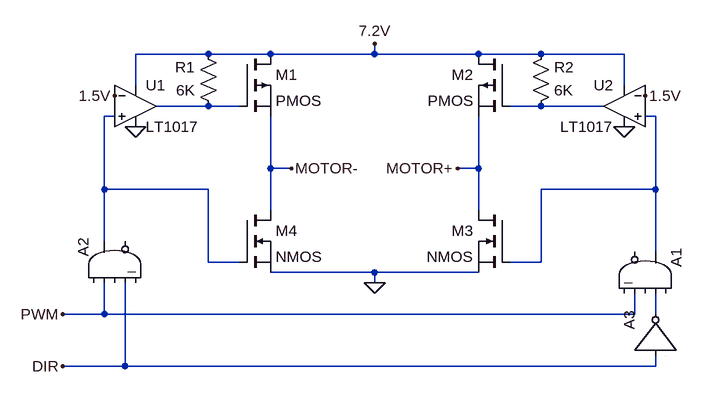
[diagram p0: schematic H_bridge.asc]
H_bridge.asc, the LTspice schematic file:
Version 4
SHEET 1 1216 680
WIRE 384 -32 272 -32
WIRE 480 -32 384 -32
WIRE 640 -32 640 -48
WIRE 640 -32 480 -32
WIRE 800 -32 640 -32
WIRE 896 -32 800 -32
WIRE 1024 -32 896 -32
WIRE 272 16 272 -32
WIRE 1024 16 1024 -32
WIRE 384 48 304 48
WIRE 432 48 384 48
WIRE 896 48 848 48
WIRE 992 48 896 48
WIRE 240 64 224 64
WIRE 1072 64 1056 64
WIRE 480 144 480 64
WIRE 512 144 480 144
WIRE 800 144 800 64
WIRE 800 144 768 144
WIRE 224 176 224 64
WIRE 384 176 224 176
WIRE 1072 176 1072 64
WIRE 1072 176 896 176
WIRE 480 208 480 144
WIRE 800 208 800 144
WIRE 224 256 224 176
WIRE 1072 272 1072 176
WIRE 384 288 384 176
WIRE 432 288 384 288
WIRE 896 288 896 176
WIRE 896 288 848 288
WIRE 640 304 480 304
WIRE 800 304 640 304
WIRE 640 320 640 304
WIRE 224 368 224 320
WIRE 224 368 160 368
WIRE 1040 368 1040 336
WIRE 1040 368 224 368
WIRE 1072 368 1072 336
WIRE 256 448 256 320
WIRE 256 448 160 448
WIRE 1072 448 1072 432
WIRE 1072 448 256 448
FLAG 768 144 MOTOR+
FLAG 512 144 MOTOR-
FLAG 640 -48 7.2V
FLAG 272 80 0
FLAG 240 32 1.5V
FLAG 640 320 0
FLAG 1024 80 0
FLAG 1056 32 1.5V
FLAG 160 368 PWM
FLAG 160 448 DIR
SYMBOL pmos 432 -32 R0
SYMATTR InstName M1
SYMBOL pmos 848 -32 M0
SYMATTR InstName M2
SYMBOL nmos 848 208 M0
SYMATTR InstName M3
SYMBOL nmos 432 208 R0
SYMATTR InstName M4
SYMBOL Comparators\\LT1017 272 48 R0
SYMATTR InstName U1
SYMBOL res 400 64 R180
WINDOW 0 36 76 Left 2
WINDOW 3 36 40 Left 2
SYMATTR InstName R1
SYMATTR Value 6K
SYMBOL Comparators\\LT1017 1024 48 M0
SYMATTR InstName U2
SYMBOL res 880 64 M180
WINDOW 0 36 76 Left 2
WINDOW 3 36 40 Left 2
SYMATTR InstName R2
SYMATTR Value 6K
SYMBOL Digital\\and 1120 304 M270
SYMATTR InstName A1
SYMBOL Digital\\and 176 288 R270
SYMATTR InstName A2
SYMBOL Digital\\inv 1008 432 R270
SYMATTR InstName A3

The netlist it stands for:
* H_bridge.asc
M1 7.2V N001 MOTOR- MOTOR- PMOS
M2 7.2V N002 MOTOR+ MOTOR+ PMOS
M3 MOTOR+ N004 0 0 NMOS
M4 MOTOR- N003 0 0 NMOS
XU1 N003 1.5V 7.2V 0 N001 LT1017  ; pins In+ In- V+ V- OUT
R1 N001 7.2V 6K
XU2 N004 1.5V 7.2V 0 N002 LT1017  ; pins In+ In- V+ V- OUT
R2 N002 7.2V 6K
A1 0 N005 0 PWM 0 0 N004 0 AND
A2 0 PWM 0 DIR 0 0 N003 0 AND
A3 DIR 0 0 0 0 N005 0 0 BUF
.model NMOS NMOS
.model PMOS PMOS
.lib standard.mos
.backanno
.end